# Altium schematic sheet SWD.SchDoc
size A
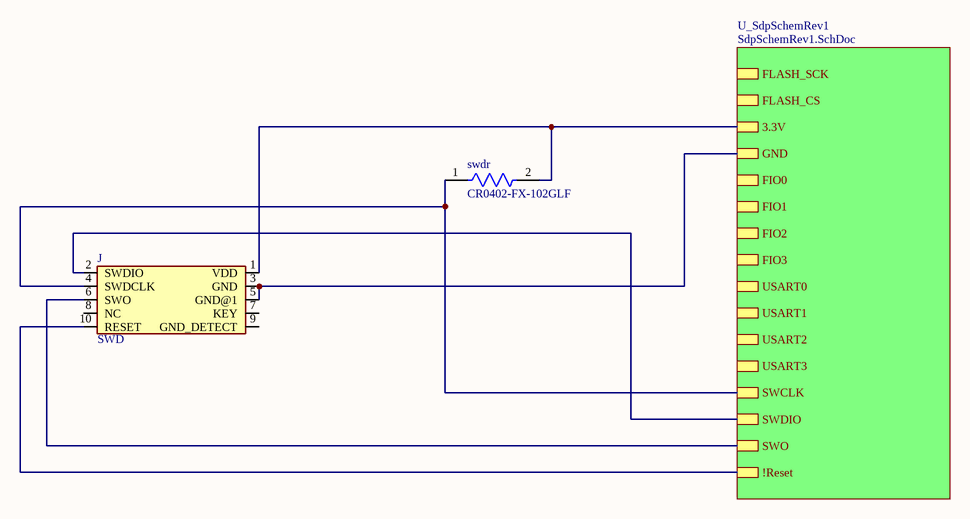
[diagram p0: SWD.SchDoc]

## Parts
J  SWD  [2X10_BOXHEADER]
swdr  CR0402-FX-102GLF  [FP-CR0402-IPC_C]

## Sub-sheets
U_SdpSchemRev1 = SdpSchemRev1.SchDoc: FLASH_SCK, FLASH_CS, 3.3V, GND, FIO0, FIO1, FIO2, FIO3, USART0, USART1, USART2, USART3, SWCLK, SWDIO, SWO, !Reset

## Nets
NetJ_1: J.1(VDD) swdr.2 ; sheet U_SdpSchemRev1/3.3V
NetJ_2: J.2(SWDIO) ; sheet U_SdpSchemRev1/SWDIO
NetJ_3: J.3(GND) J.5(GND@1) ; sheet U_SdpSchemRev1/GND
NetJ_4: J.4(SWDCLK) swdr.1 ; sheet U_SdpSchemRev1/SWCLK
NetJ_6: J.6(SWO) ; sheet U_SdpSchemRev1/SWO
NetJ_10: J.10(RESET) ; sheet U_SdpSchemRev1/!Reset

Not connected (* = marked no-connect by the designer): J 7(KEY) 8(NC) 9(GND_DETECT)

## Library data of the parts
J = SWD: SWD WRITEON W/DISP .75X1.4 LAB; MF: 3M; Price: None; Value: *; Package: None; SnapEDA_Link: https://www.snapeda.com/parts/SWD/3M%20%28TC%29/view-part/172681/?ref=snap; MP: SWD; Availability: Unavailable
swdr = CMP-2002-04703-2: Thick Film Chip Resistors 0402 1kΩ 0.0625W 1% 100ppm/°C; Voltage Rating: 50V; Max Power Dissipation: 63mW; Resistance: 1kR; Power Rating: 62.5mW; Package Quantity: 10000; Radiation Hardening: No; Temperature Coefficient: 100ppm/°C; Number of Terminations: 2; Packaging: Tape and Reel; Thickness: 356um; Case Code (Metric): 1005; Case/Package: 0402; Case Code (Imperial): 0402; Max Operating Temperature: 155°C; Composition: Thick Film; Min Operating Temperature: -55°C; Mount: Surface Mount; Tolerance: 1%; Termination: SMD/SMT; Width: 0.02inch; Contact Plating: Tin; Height: 0.016inch; Length: 0.039inch